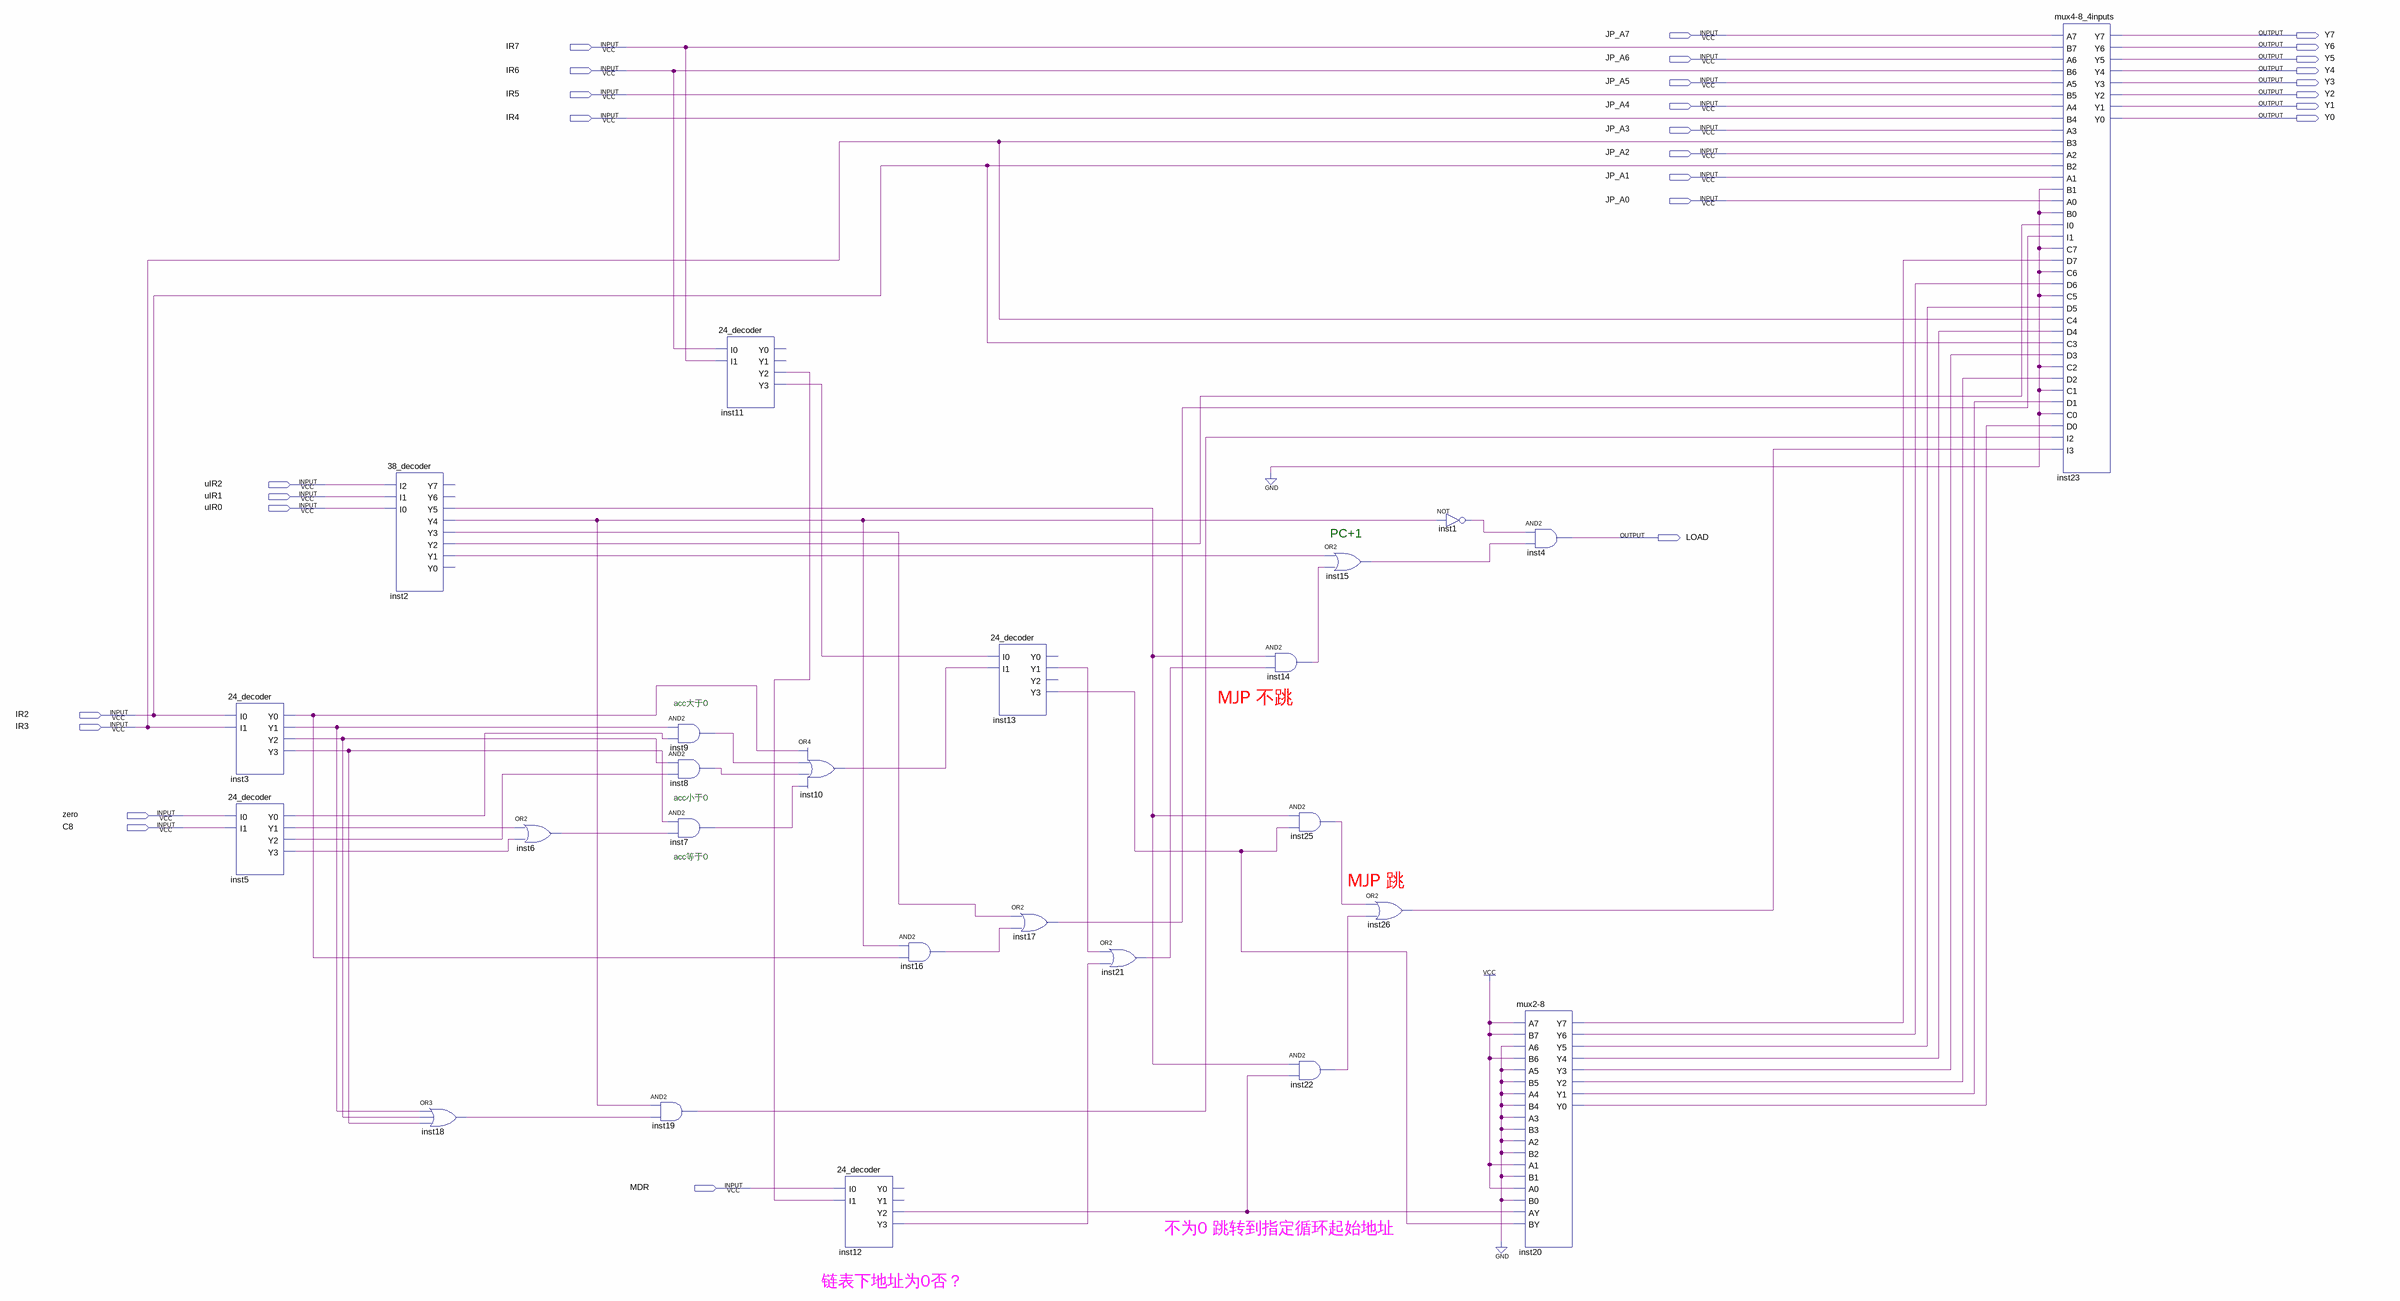
[diagram p0: schematic sheet]
// Quartus schematic micro_address_generator.bdf as structural Verilog: 25 symbols, 29 pins
module micro_address_generator (
  input  JP_A7,
  input  IR7,
  input  JP_A6,
  input  IR6,
  input  JP_A5,
  input  IR5,
  input  JP_A4,
  input  IR4,
  input  JP_A3,
  input  JP_A2,
  input  JP_A1,
  input  JP_A0,
  input  uIR2,
  input  uIR1,
  input  uIR0,
  input  IR2,
  input  IR3,
  input  zero,
  input  C8,
  input  MDR,
  output Y7,
  output Y6,
  output Y5,
  output Y4,
  output Y3,
  output Y2,
  output Y1,
  output Y0,
  output LOAD
);

  wire inst1_out, inst2_y1, inst2_y2, inst2_y3, inst2_y4, inst2_y5, inst3_y0, inst3_y1, inst3_y2, inst3_y3,
       inst5_y0, inst5_y1, inst5_y2, inst5_y3, inst6_out, inst7_out, inst8_out, inst9_out, inst10_out,
       inst11_y2, inst11_y3, inst12_y2, inst12_y3, inst13_y1, inst13_y3, inst14_out, inst15_out, inst16_out,
       inst17_out, inst18_out, inst19_out, inst20_y0, inst20_y1, inst20_y2, inst20_y3, inst20_y4, inst20_y5,
       inst20_y6, inst20_y7, inst21_out, inst22_out, inst25_out, inst26_out;

  \24_decoder  inst3 (.I0(IR2), .I1(IR3), .Y0(inst3_y0), .Y1(inst3_y1), .Y2(inst3_y2), .Y3(inst3_y3));
  \24_decoder  inst5 (.I0(zero), .I1(C8), .Y0(inst5_y0), .Y1(inst5_y1), .Y2(inst5_y2), .Y3(inst5_y3));
  \38_decoder  inst2 (
    .I2(uIR2), .I1(uIR1), .I0(uIR0), .Y5(inst2_y5), .Y4(inst2_y4), .Y3(inst2_y3), .Y2(inst2_y2), .Y1(inst2_y1));  // open: Y7, Y6, Y0
  or inst18 (inst18_out, inst3_y1, inst3_y2, inst3_y3);
  or inst6 (inst6_out, inst5_y1, inst5_y3);
  and inst9 (inst9_out, inst3_y1, inst5_y0);
  and inst8 (inst8_out, inst3_y2, inst5_y2);
  and inst7 (inst7_out, inst3_y3, inst6_out);
  and inst19 (inst19_out, inst2_y4, inst18_out);
  \24_decoder  inst11 (.I0(IR6), .I1(IR7), .Y2(inst11_y2), .Y3(inst11_y3));  // open: Y0, Y1
  or inst10 (inst10_out, inst3_y0, inst9_out, inst8_out, inst7_out);
  \24_decoder  inst12 (.I0(MDR), .I1(inst11_y2), .Y2(inst12_y2), .Y3(inst12_y3));  // open: Y0, Y1
  and inst16 (inst16_out, inst2_y4, inst3_y0);
  \24_decoder  inst13 (.I0(inst11_y3), .I1(inst10_out), .Y1(inst13_y1), .Y3(inst13_y3));  // open: Y0, Y2
  or inst17 (inst17_out, inst2_y3, inst16_out);
  or inst21 (inst21_out, inst13_y1, inst12_y3);
  and inst14 (inst14_out, inst2_y5, inst21_out);
  and inst25 (inst25_out, inst2_y5, inst13_y3);
  and inst22 (inst22_out, inst2_y5, inst12_y2);
  or inst15 (inst15_out, inst2_y1, inst14_out);
  or inst26 (inst26_out, inst25_out, inst22_out);
  not inst1 (inst1_out, inst2_y4);
  and inst4 (LOAD, inst1_out, inst15_out);
  \mux2-8  inst20 (
    .A7(1'b1), .B7(1'b1), .A6(1'b0), .B6(1'b1), .A5(1'b0), .B5(1'b0), .A4(1'b0), .B4(1'b0), .A3(1'b0),
    .B3(1'b0), .A2(1'b0), .B2(1'b0), .A1(1'b1), .B1(1'b0), .A0(1'b1), .B0(1'b0), .AY(inst12_y2),
    .BY(inst13_y3), .Y7(inst20_y7), .Y6(inst20_y6), .Y5(inst20_y5), .Y4(inst20_y4), .Y3(inst20_y3),
    .Y2(inst20_y2), .Y1(inst20_y1), .Y0(inst20_y0));
  \mux4-8_4inputs  inst23 (
    .A7(JP_A7), .B7(IR7), .A6(JP_A6), .B6(IR6), .A5(JP_A5), .B5(IR5), .A4(JP_A4), .B4(IR4), .A3(JP_A3),
    .B3(IR3), .A2(JP_A2), .B2(IR2), .A1(JP_A1), .B1(1'b0), .A0(JP_A0), .B0(1'b0), .I0(inst2_y2),
    .I1(inst17_out), .C7(1'b0), .D7(inst20_y7), .C6(1'b0), .D6(inst20_y6), .C5(1'b0), .D5(inst20_y5),
    .C4(IR3), .D4(inst20_y4), .C3(IR2), .D3(inst20_y3), .C2(1'b0), .D2(inst20_y2), .C1(1'b0), .D1(inst20_y1),
    .C0(1'b0), .D0(inst20_y0), .I2(inst19_out), .I3(inst26_out), .Y7(Y7), .Y6(Y6), .Y5(Y5), .Y4(Y4), .Y3(Y3),
    .Y2(Y2), .Y1(Y1), .Y0(Y0));

  // Notes on the sheet:
  //   PC+1
  //   MJP 不跳
  //   acc大于0
  //   acc小于0
  //   acc等于0
  //   MJP 跳
  //   不为0 跳转到指定循环起始地址
  //   链表下地址为0否？
endmodule
